# Altium schematic sheet Sheet1.SchDoc
size A4; SheetNumber: 1; SheetTotal: 1
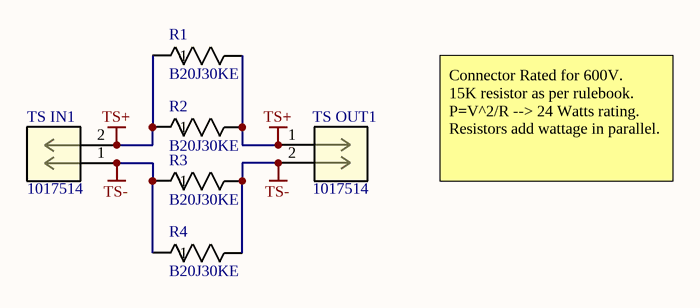
[diagram p0: Sheet1.SchDoc]

## Parts
R1  B20J30KE  [RES_B20_OHM]
R2  B20J30KE  [RES_B20_OHM]
R3  B20J30KE  [RES_B20_OHM]
R4  B20J30KE  [RES_B20_OHM]
TS_IN1  1017514  [CONN_1017514]
TS_OUT1  1017514  [CONN_1017514]

## Nets
TS+: R1.1 R1.2 R2.1 R2.2 TS_IN1.2 TS_OUT1.1
TS-: R3.1 R3.2 R4.1 R4.2 TS_IN1.1 TS_OUT1.2

## Notes on the sheet
- Connector Rated for 600V.
  15K resistor as per rulebook.
  P=V^2/R --> 24 Watts rating.
  Resistors add wattage in parallel.

## Library data of the parts
R1-R4 = B20J30KE: No Description Available; Mfr_Name: Ohmite
TS_IN1 TS_OUT1 = CMP-002-00077-5: Barrier Strip Terminal Block; RoHS Compliant: Yes